# EAGLE board kulgurpowerMCU3-unrouted (EAGLE 6.3)
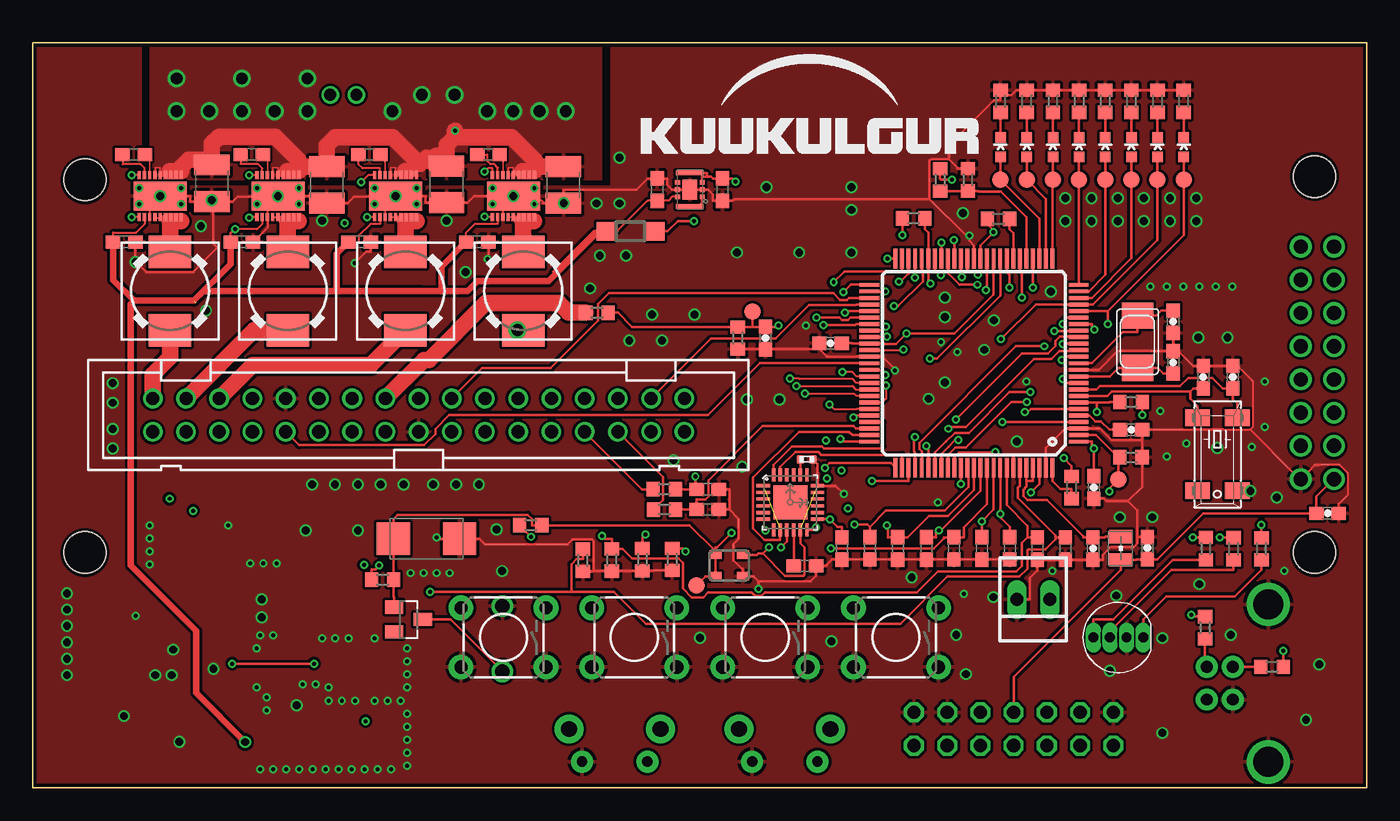
[diagram p6: board, top side]
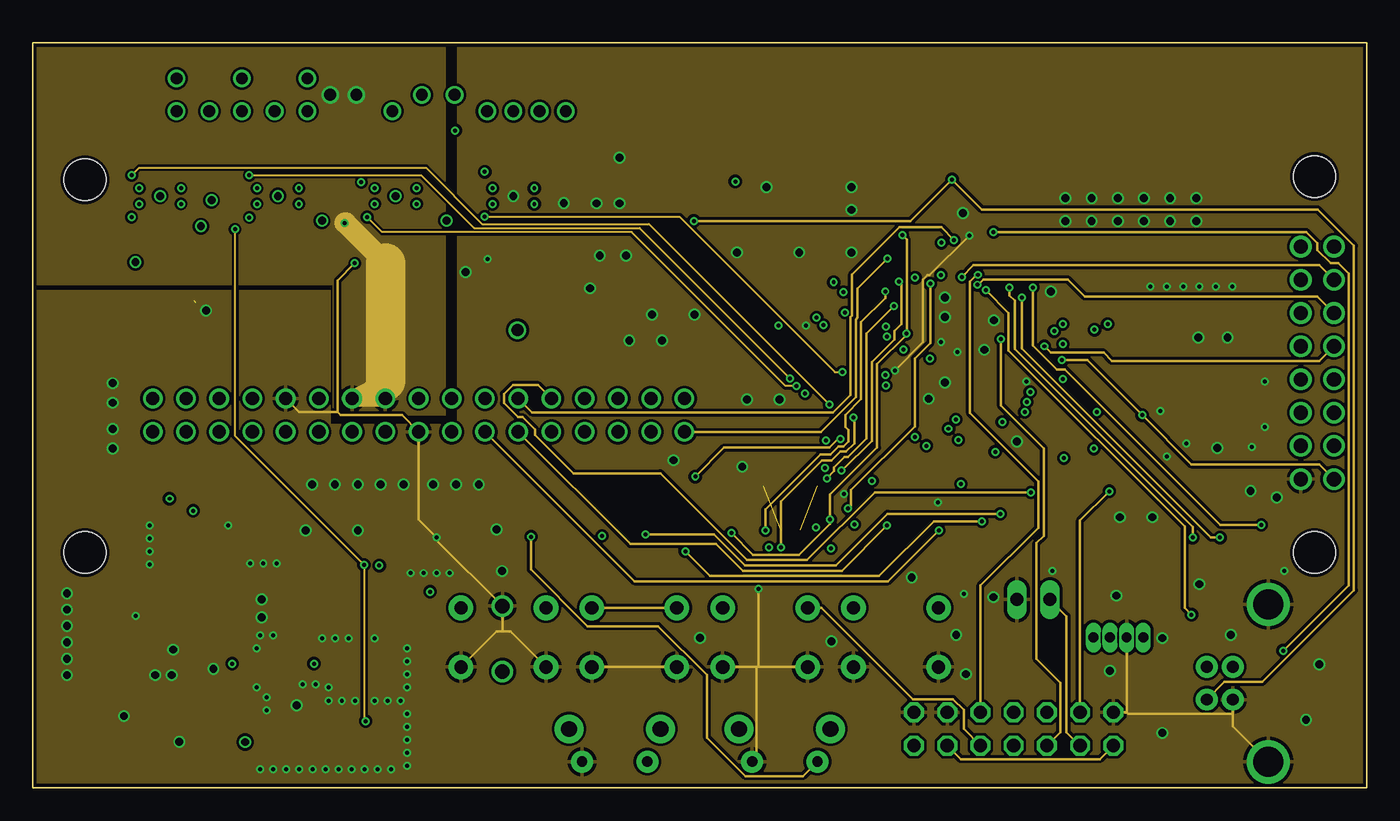
[diagram p7: board, inner layer Route2]
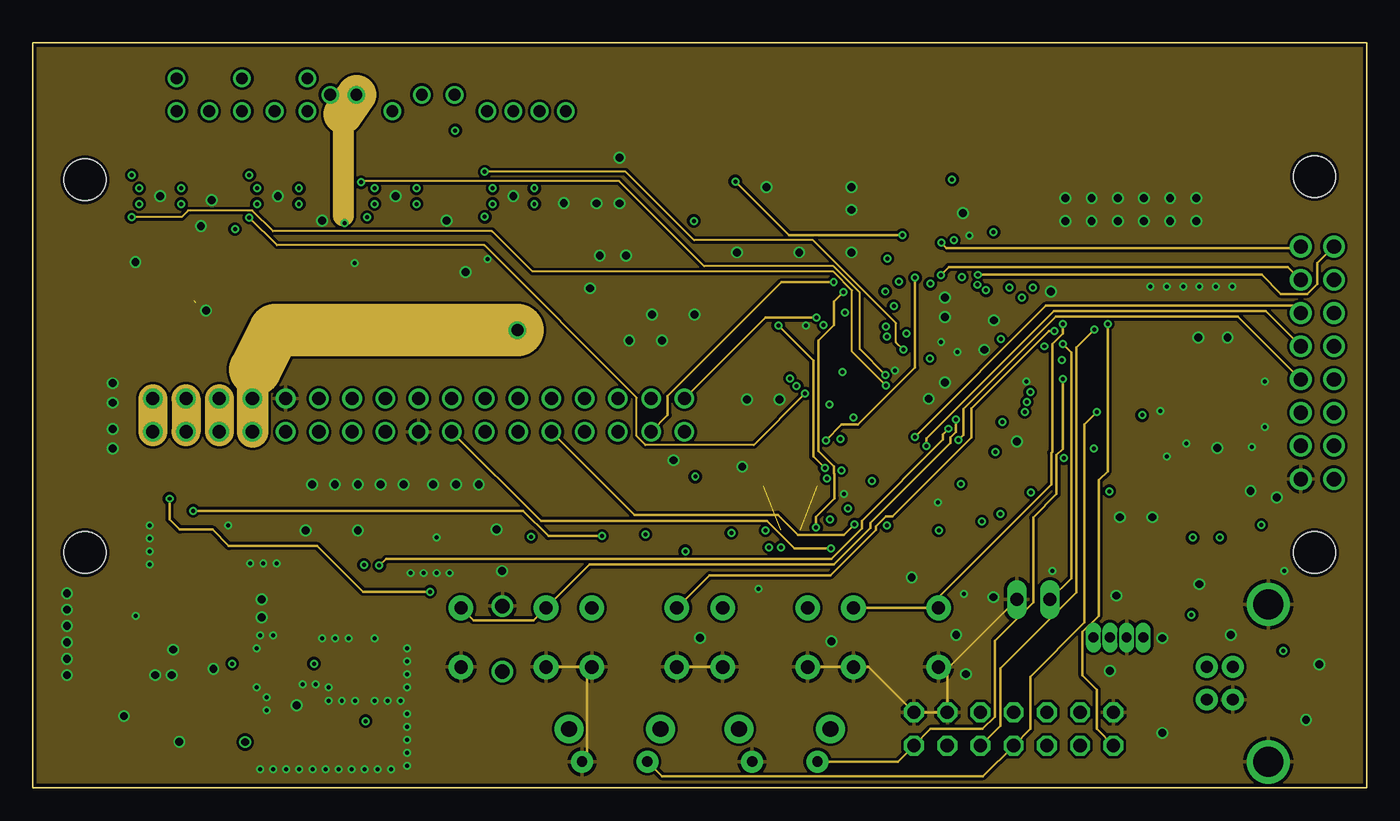
[diagram p8: board, inner layer Route15]
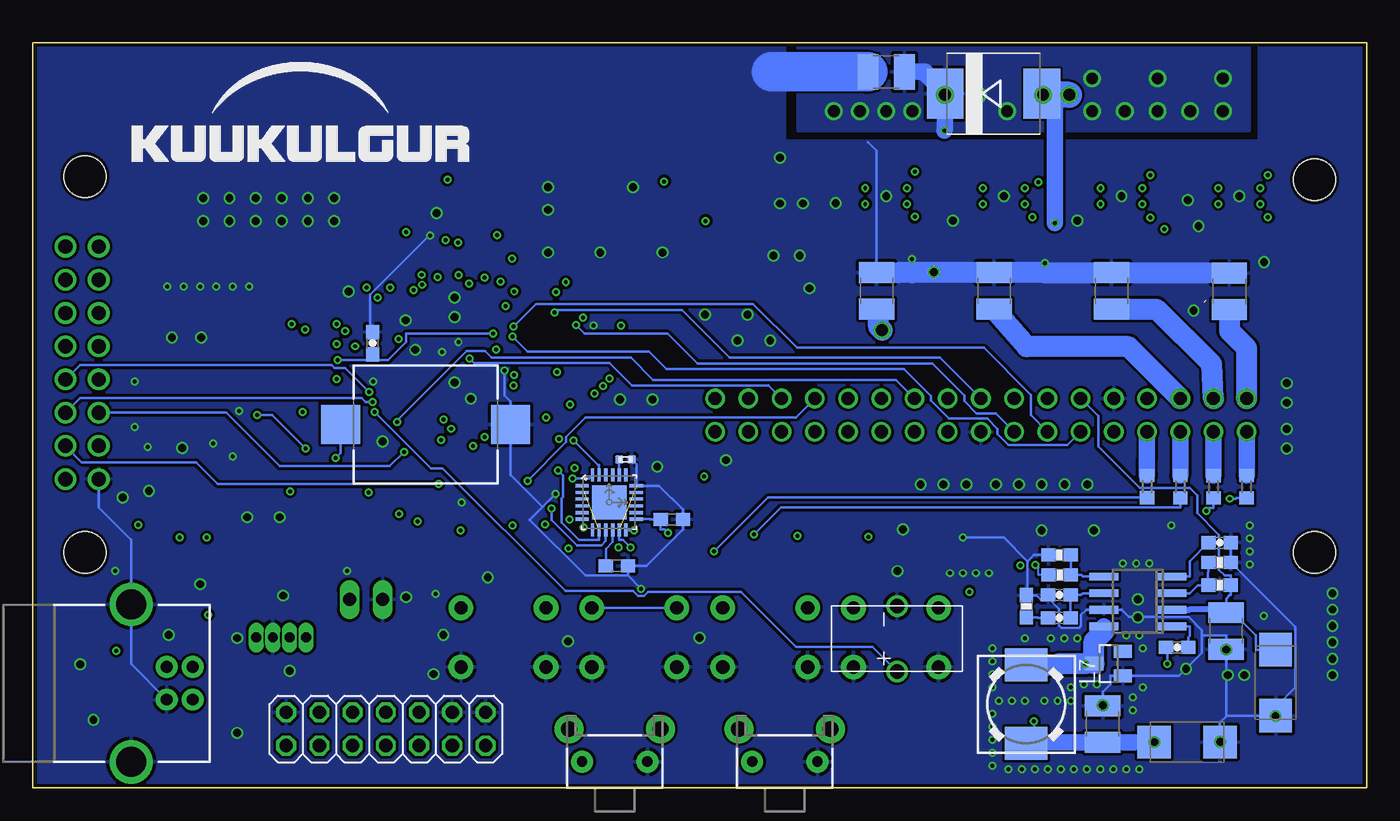
[diagram p9: board, bottom side, seen from below]

Size 102 x 57 mm. Coordinates in mm from the lower left corner, seen from the top.
Outline: 0,0 0,57 102,57 102,0 0,0
Copper layers (1*2*15*16): Top 0.035mm / dielectric 0.2mm / Route2 0.0175mm / dielectric 1.1mm / Route15 0.0175mm / dielectric 0.2mm / Bottom 0.035mm
Design rules "SeeedStudio_DRU_no_angle_20130527": minimum track width 6mil, minimum drill 12mil, track to track 6mil, track to pad 6mil, pad to pad 6mil, via to via 6mil, smd to smd 0mil, copper to edge 10mil, drill to drill 10mil, minimum pad ring 6mil, minimum via ring 6mil, stop-mask expansion 2mil, vias tented up to drill 25mil, thermal gap 10mil
Net classes: 0 default: width 0.203 mm, drill 0.3 mm, clearance 0.203 mm; 1 power: width 0.635 mm, drill 0.6 mm, clearance 0.178 mm; 2 morepower: width 1.27 mm, drill 1 mm, clearance 0.178 mm; 3 thin: width 0.152 mm, drill 0.3 mm, clearance 0.152 mm

## Footprints (pad centres in the part's own frame; a part is rotated, then mirrored left to right if it is on the bottom)
B1,27 = smd 1.27 x 1.27: TP 0,0
C0603 = smd 1.1 x 1: 1 -0.85,0; 2 0.85,0
0603-CAP = smd 1.1 x 1: 1 -0.85,0; 2 0.85,0
C/6032-28R = smd 2.55 x 2.5: + 2.525,0; - -2.525,0
C0402 = smd 0.59 x 0.64: 1 -0.48,0; 2 0.48,0
C1210 = smd 1.6 x 2.7: 1 -1.4,0; 2 1.4,0
SMC = smd 2.8 x 3.8: A 3.7,0; C -3.7,0
SOD123 = smd 1.4 x 1.4: A 1.9,0; C -1.9,0
SOT23 = smd 1 x 1.4: 1 -0.95,-1.1; 2 0.95,-1.1; 3 0,1.1
LED-RGB-THRU = drill 0.762 pad 0.889 long: 1 1.905,0; 2 0.635,0; 3 -0.635,0; 4 -1.905,0
2X07 = drill 1.016 octagon: 1 -7.62,-1.27; 2 -7.62,1.27; 3 -5.08,-1.27; 4 -5.08,1.27; 5 -2.54,-1.27; 6 -2.54,1.27; 7 0,-1.27; 8 0,1.27; 9 2.54,-1.27; 10 2.54,1.27; 11 5.08,-1.27; 12 5.08,1.27; 13 7.62,-1.27; 14 7.62,1.27
WE-KI_0805_B = smd 1.02 x 1.78: 1 -0.89,0; 2 0.89,0
DR73 = smd 2.5 x 3.25: 1 -3,0; 2 3,0
LED-0603 = smd 0.8 x 0.8: A 0,-0.75; C 0,0.75
MM20SS = smd 1.27 x 1.88: 1 -2.794,-1.524; 2 2.794,-1.524; 3 2.794,1.524; 4 -2.794,1.524
R0603 = smd 1 x 1.1: 1 -0.85,0; 2 0.85,0
0603-RES = smd 1.1 x 1: 1 -0.85,0; 2 0.85,0
TACTILE-PTH-SIDEEZ = drill 0.8 pad 1.7: 1 -2.5,0; 2 2.5,0 | drill 1.2 pad 2.2: ANCHOR1 -3.5,2.5; ANCHOR2 3.5,2.5
TACTILE-PTH = drill 1.016 pad 1.88: 1 -3.251,2.261; 2 3.251,2.261; 3 -3.251,-2.261; 4 3.251,-2.261
BUZZER-CMT1102 = smd 3 x 3: 1 -6.5,0; 2 6.5,0
QFN-24-TESTING = smd 1.016 x 0.254: 1 -2.066,1.257; 2 -2.066,0.75; 3 -2.066,0.247; 4 -2.066,-0.287; 5 -2.066,-0.792; 6 -2.066,-1.297; 13 2.086,-1.297; 14 2.086,-0.792; 15 2.086,-0.287; 16 2.086,0.247; 17 2.086,0.75; 18 2.086,1.257 | smd 0.254 x 1.016: 7 -1.267,-2.122; 8 -0.762,-2.122; 9 -0.258,-2.122; 10 0.278,-2.122; 11 0.78,-2.122; 12 1.287,-2.122; 19 1.287,2.082; 20 0.78,2.082; 21 0.278,2.082; 22 -0.258,2.082; 23 -0.762,2.082; 24 -1.267,2.082 | smd 2.616 x 2.616: P$1 0.02,-0.01
EDLRD224V3R6C = drill 1.1: N 2.5,0; P -2.5,0
USB-B-PTH = drill 0.914 pad 1.676: D+ 0,1.25; D- 1.981,1.25; GND 0,-1.25; VBUS 1.981,-1.25 | drill 2.286: S1 -2.718,-6.02; S2 -2.718,6.02
ER-OLEDM032-1 = drill 1.1: P$1 96.2,8.11; P$2 98.74,8.11; P$3 96.2,10.65; P$4 98.74,10.65; P$5 96.2,13.19; P$6 98.74,13.19; P$7 96.2,15.73; P$8 98.74,15.73; P$9 96.2,18.27; P$10 98.74,18.27; P$11 96.2,20.81; P$12 98.74,20.81; P$13 96.2,23.35; P$14 98.74,23.35; P$15 96.2,25.89; P$16 98.74,25.89 | hole 3.2: 3.25,31; 3.25,2.5; 97.25,2.5; 97.25,31.25
ASE = smd 0.9 x 0.65: 1 -1.05,-0.825; 2 1.05,-0.825; 3 1.05,0.825; 4 -1.05,0.825
SO8 = smd 0.6 x 2.2: 1 -1.905,-2.6; 2 -0.635,-2.6; 3 0.635,-2.6; 4 1.905,-2.6; 5 1.905,2.6; 6 0.635,2.6; 7 -0.635,2.6; 8 -1.905,2.6
CL2025 = smd 0.35 x 0.375: P$1 -0.55,-0.938; P$2 0,-0.938; P$3 0.55,-0.938; P$4 0.55,0.938; P$5 0,0.938; P$6 -0.55,0.938 | smd 0.35 x 2.1: P$7 -1.275,0; P$8 1.275,0 | smd 1.5 x 1.1: PAD 0,0
LTQFP100 = smd 1.5 x 0.3: 1 -8,6; 2 -8,5.5; 3 -8,5; 4 -8,4.5; 5 -8,4; 6 -8,3.5; 7 -8,3; 8 -8,2.5; 9 -8,2; 10 -8,1.5; 11 -8,1; 12 -8,0.5; 13 -8,0; 14 -8,-0.5; 15 -8,-1; 16 -8,-1.5; 17 -8,-2; 18 -8,-2.5; 19 -8,-3; 20 -8,-3.5; 21 -8,-4; 22 -8,-4.5; 23 -8,-5; 24 -8,-5.5; 25 -8,-6; 51 8,-6; 52 8,-5.5; 53 8,-5; 54 8,-4.5; 55 8,-4; 56 8,-3.5; 57 8,-3; 58 8,-2.5; 59 8,-2; 60 8,-1.5; 61 8,-1; 62 8,-0.5; 63 8,0; 64 8,0.5; 65 8,1; 66 8,1.5; 67 8,2; 68 8,2.5; 69 8,3; 70 8,3.5; 71 8,4; 72 8,4.5; 73 8,5; 74 8,5.5; 75 8,6 | smd 0.3 x 1.5: 26 -6,-8; 27 -5.5,-8; 28 -5,-8; 29 -4.5,-8; 30 -4,-8; 31 -3.5,-8; 32 -3,-8; 33 -2.5,-8; 34 -2,-8; 35 -1.5,-8; 36 -1,-8; 37 -0.5,-8; 38 0,-8; 39 0.5,-8; 40 1,-8; 41 1.5,-8; 42 2,-8; 43 2.5,-8; 44 3,-8; 45 3.5,-8; 46 4,-8; 47 4.5,-8; 48 5,-8; 49 5.5,-8; 50 6,-8; 76 6,8; 77 5.5,8; 78 5,8; 79 4.5,8; 80 4,8; 81 3.5,8; 82 3,8; 83 2.5,8; 84 2,8; 85 1.5,8; 86 1,8; 87 0.5,8; 88 0,8; 89 -0.5,8; 90 -1,8; 91 -1.5,8; 92 -2,8; 93 -2.5,8; 94 -3,8; 95 -3.5,8; 96 -4,8; 97 -4.5,8; 98 -5,8; 99 -5.5,8; 100 -6,8
CSD97374Q4M = smd 0.25 x 0.6: P$1 -1.6,-1.6; P$2 -1.2,-1.6; P$3 -0.8,-1.6; P$4A -0.4,-1.6; P$4B 0,-1.6; P$4C 0.4,-1.6; P$4D 0.8,-1.6; P$4E 1.2,-1.6; P$4F 1.6,-1.6; P$5A -0.4,1.6; P$5B 0,1.6; P$5C 0.4,1.6; P$5D 0.8,1.6; P$5E 1.2,1.6; P$5F 1.6,1.6; P$6 -0.8,1.6; P$7 -1.2,1.6; P$8 -1.6,1.6 | smd 4.05 x 2.2: PAD@1 0,0 | drill 0.3: PAD@9 -1.6,0.6; PAD@10 -1.6,-0.6; PAD@11 1.6,0.6; PAD@12 1.6,-0.6
NX5032 = smd 2 x 2.4: P$1 2,0; P$2 -2,0
PAK100/2500-34 = drill 1 pad 1.422: 1 -20.32,-1.27; 2 -20.32,1.27; 3 -17.78,-1.27; 4 -17.78,1.27; 5 -15.24,-1.27; 6 -15.24,1.27; 7 -12.7,-1.27; 8 -12.7,1.27; 9 -10.16,-1.27; 10 -10.16,1.27; 11 -7.62,-1.27; 12 -7.62,1.27; 13 -5.08,-1.27; 14 -5.08,1.27; 15 -2.54,-1.27; 16 -2.54,1.27; 17 0,-1.27; 18 0,1.27; 19 2.54,-1.27; 20 2.54,1.27; 21 5.08,-1.27; 22 5.08,1.27; 23 7.62,-1.27; 24 7.62,1.27; 25 10.16,-1.27; 26 10.16,1.27; 27 12.7,-1.27; 28 12.7,1.27; 29 15.24,-1.27; 30 15.24,1.27; 31 17.78,-1.27; 32 17.78,1.27; 33 20.32,-1.27; 34 20.32,1.27
22-23-2021 = drill 1 long: 1 -1.27,0; 2 1.27,0

## Placement (x,y rotation side)
AN0  TPB1,27  [B1,27]  55.05,36.42 90 top
C1  0.1  [C0603]  72.57,18.31 270 top
C2  0.1  [C0603]  74.69,18.32 270 top
C3  0.1  [C0603]  66.13,18.31 270 top
C4  0.1  [0603-CAP]  83.98,27.39 180 top
C5  0.1  [C0603]  64.01,18.32 270 top
C6  18pf  [0603-CAP]  87.19,32.54 270 top
C7  18pf  [0603-CAP]  87.19,35.64 90 top
C8  0.1  [C0603]  76.82,18.3 270 top
C9  [0603-CAP]  89.49,31.41 270 top
C10  0.1  [C0603]  68.32,18.31 270 top
C11  [0603-CAP]  91.76,31.41 270 top
C12  0.1  [0603-CAP]  56.03,34.4 270 top
C13  0,1  [0603-CAP]  81.07,18.3 270 top
C14  0,1  [0603-CAP]  85.23,18.33 90 top
C15  0.1  [C0603]  78.94,18.3 270 top
C17  0.1  [C0603]  70.44,18.32 270 top
C18  [C/6032-28R]  30.11,19.05 180 top
C19  100n  [C0603]  59.05,16.97 0 top
C20  2.2nF / 50V  [C0402]  59.18,25.12 0 top
C21  100n  [C0603]  61.88,18.3 270 top
C22  0.1  [C0603]  51.61,22.83 0 top
C24  100n  [C0603]  57.33,16.98 0 bottom
C25  2.2nF / 50V  [C0402]  56.68,25.11 0 bottom
C26  100n  [C0603]  53.13,20.52 0 bottom
C27  0.1  [C0603]  7.72,48.41 0 top
C28  0.1  [0603-CAP]  14.5,10.75 0 bottom
C29  0.1  [C0603]  25,41.75 0 top
C30  22uF/25V  [C1210]  31.64,46.15 270 top
C31  0.1  [C0603]  16.75,48.43 0 top
C32  0.1  [C0603]  7,41.75 0 top
C33  22uF/25V  [C1210]  40.57,46.11 270 top
C34  0.1  [C0603]  25.74,48.43 0 top
C35  0.1  [C0603]  16,41.75 0 top
C36  22uF/25V  [C1210]  22.49,46.11 270 top
C37  0.1  [C0603]  34.84,48.43 0 top
C38  0.1  [C0603]  34,41.75 0 top
C39  22uF/25V  [C1210]  13.69,46.24 270 top
C40  0.1  [C0603]  51.61,21.29 0 top
C42  [C1210]  10.51,37.98 90 bottom
C43  [C1210]  19.52,38 90 bottom
C44  [C1210]  28.5,38 90 bottom
C45  [C1210]  37.48,38 90 bottom
C46  0,1  [0603-CAP]  61,34 180 top
C47  0,1  [0603-CAP]  76,34 90 bottom
C48  0,1  [0603-CAP]  81.14,22.98 270 top
C49  0,1  [0603-CAP]  99,21 0 top
C50  22uF/25V  [C1210]  36.75,54.75 180 bottom
C51  12pF  [0603-CAP]  23.5,14.75 180 bottom
C52  180pF  [0603-CAP]  23.5,13 180 bottom
C53  10uF / 6.3V  [C0603]  52.75,45.75 90 top
C54  4.7uF / 10V  [C0603]  47.75,45.75 270 top
C55  15nF  [0603-CAP]  11.25,18.75 180 bottom
C56  GRM32ER71E226KE15L  [C1210]  10.75,12 270 bottom
C57  GRM32ER71E226KE15L  [C1210]  20.19,4.89 90 bottom
C58  100uF/16V  [C/6032-28R]  6.98,8.04 90 bottom
C100  100uF/10V  [C/6032-28R]  13.75,3.5 180 bottom
D1  MBRS320T3  [SMC]  28.54,53.08 0 bottom
D2  MBR0520LT  [SOD123]  45.69,42.56 0 top
D7  BAT54  [SOT23]  28.73,12.87 270 top
D8  WP154A4SUREQBFZGW  [LED-RGB-THRU]  83,11.5 0 top
D100  BAT54  [SOT23]  19.75,9.5 90 bottom
EMLE  TPB1,27  [B1,27]  82.99,23.58 0 top
JP2  [2X07]  75,4.5 0 bottom
L1  4,7uH  [WE-KI_0805_B]  83.19,18.32 90 top
L2  4,7uH  [DR73]  10.5,38 270 top
L3  4,7uH  [DR73]  19.5,38 270 top
L4  4,7uH  [DR73]  28.5,38 270 top
L5  4,7uH  [DR73]  37.5,38 270 top
L7  4,7uH  [DR73]  26.04,6.4 270 bottom
LED0  [LED-0603]  74,49 0 top
LED1  [LED-0603]  76,49 0 top
LED2  [LED-0603]  78,49 0 top
LED3  [LED-0603]  80,49 0 top
LED4  [LED-0603]  82,49 0 top
LED5  [LED-0603]  84,49 0 top
LED6  [LED-0603]  86,49 0 top
LED7  [LED-0603]  88,49 0 top
Q1  [MM20SS]  90.57,25.51 270 top
R1  301k  [R0603]  16.8,23.04 270 bottom
R2  100k  [R0603]  48.89,17.47 270 top
R3  301k  [R0603]  14.26,23.03 270 bottom
R4  100k  [R0603]  46.62,17.45 270 top
R5  47k  [R0603]  83.98,29.51 0 top
R6  47k  [R0603]  26.76,15.91 0 top
R7  1k  [R0603]  74,52.5 270 top
R8  1k  [R0603]  76,52.5 270 top
R9  47k  [R0603]  67.36,43.54 0 top
R10  1k5  [R0603]  73.84,43.51 180 top
R11  301k  [R0603]  11.72,23.02 270 bottom
R12  1k  [R0603]  78,52.5 270 top
R13  100k  [R0603]  44.28,17.42 270 top
R14  1k  [R0603]  80,52.5 270 top
R15  47k  [R0603]  83.97,25.27 0 top
R16  301k  [R0603]  9.19,23.03 270 bottom
R17  100k  [R0603]  42.06,17.4 270 top
R18  100k  [R0603]  53.92,34.4 270 top
R19  1k  [R0603]  79.43,22.96 270 top
R20  100k  [0603-RES]  11.25,15.5 0 bottom
R21  63k4  [0603-RES]  26.03,13.89 270 bottom
R22  47k  [R0603]  38.08,20.08 180 top
R23  680k  [R0603]  43.14,36.33 180 top
R24  22r  [R0603]  89.63,12.24 270 top
R25  22r  [R0603]  94.75,9.25 180 top
R26  30k  [R0603]  71.5,46.5 90 top
R27  17k  [R0603]  69.38,46.49 270 top
R28  1k  [R0603]  82,52.5 270 top
R29  1k  [R0603]  84,52.5 270 top
R30  1k  [R0603]  86,52.5 270 top
R31  1k  [R0603]  88,52.5 270 top
R32  1k  [R0603]  93.94,18.27 90 top
R33  1k  [R0603]  91.81,18.28 90 top
R34  1k  [R0603]  89.69,18.29 90 top
R35  10k  [R0603]  48.29,22.83 0 top
R36  10k  [R0603]  48.31,21.29 0 top
R37  1k87  [0603-RES]  23.49,17.81 180 bottom
R38  10k  [0603-RES]  23.48,16.28 0 bottom
R45  21k5  [0603-RES]  11.25,17.25 180 bottom
S1  PROG  [TACTILE-PTH-SIDEEZ]  44.5,2 0 bottom
S2  SW4  [TACTILE-PTH]  66,11.5 180 top
S6  SW1  [TACTILE-PTH]  36,11.5 180 top
S7  SW2  [TACTILE-PTH]  46,11.5 180 top
S8  SW3  [TACTILE-PTH]  56,11.5 180 top
S9  RESET  [TACTILE-PTH-SIDEEZ]  57.5,2 0 bottom
SG1  BUZZERSMD3  [BUZZER-CMT1102]  71.97,27.79 0 bottom
TP1  TPB1,27  [B1,27]  50.75,15.5 0 top
TPLED0  LED0  [B1,27]  74,46.5 90 top
TPLED1  LED0  [B1,27]  76,46.5 90 top
TPLED2  LED0  [B1,27]  78,46.5 90 top
TPLED3  LED0  [B1,27]  80,46.5 90 top
TPLED4  LED0  [B1,27]  82,46.5 90 top
TPLED5  LED0  [B1,27]  84,46.5 90 top
TPLED6  LED0  [B1,27]  86,46.5 90 top
TPLED7  LED0  [B1,27]  88,46.5 90 top
U1  MPU-6000QFN-24  [QFN-24-TESTING]  57.91,21.84 0 top
U2  MPU-6000QFN-24  [QFN-24-TESTING]  57.93,21.84 0 bottom
U$1  EDLRD224V3R6C  [EDLRD224V3R6C]  35.91,11.4 90 bottom
U$2  USB+SHIELD  [USB-B-PTH]  91.75,8 0 bottom
U$3  ER-OLEDM032-1  [ER-OLEDM032-1]  0.75,15.5 0 top
U$4  ASE  [ASE]  53.25,17 0 top
U$5  TPS54332  [SO8]  17.5,14.25 90 bottom
U$6  XCL202B331BR-G  [CL2025]  50.25,45.75 90 top
U$14  R5F5630ADDFP  [LTQFP100]  71.97,32.47 180 top
U$16  CSD97374Q4M  [CSD97374Q4M]  9.75,45.25 0 top
U$17  CSD97374Q4M  [CSD97374Q4M]  18.75,45.25 0 top
U$18  CSD97374Q4M  [CSD97374Q4M]  27.75,45.25 0 top
U$19  CSD97374Q4M  [CSD97374Q4M]  36.75,45.25 0 top
X1  12Mhz  [NX5032]  84.47,34.12 270 top
X2  2534-  [PAK100/2500-34]  29.5,28.5 0 top
X3  22-23-2021  [22-23-2021]  76.5,14.4 180 top

## Tracks (layer width: path | path; a pad name or v marks a point on that pad's centre or on a via)
5V  (via drill 0.3 pad 0.61, 0.6 pad 0.3)  (1 unrouted)
  Top 0.152: 12.45,37.12 10.05,37.12 | 39.76,39.46 42.86,42.56 43.25,42.56 D2.C 44.72,42.56 44.72,42.6 47.02,44.9 C54.2 48.6,44.9 48.9,45.2 U$6.P$6 | C29.1 24.93,41.75 24.93,42.22 25.83,43.12 26.55,43.12 U$18.P$2 | U$17.P$2 17.55,43.12 17.15,42.72 v15.46,42.72 15.22,42.48 15.15,42.48 C35.1 | 33.15,41.77 C38.1 33.15,41.77 | 33.15,41.77 33.15,42.48 33.79,43.12 35.55,43.12 U$19.P$2 | 6.15,41.02 C32.1 6.15,42.48 7.91,42.48 8.55,43.12 U$16.P$2
  Top 0.508: 12.32,37.25 7.75,37.25 | 7.75,37.25 7.5,37 7.5,17 12.5,12 12.5,7.25 v16.25,3.5 | v16.25,3.5 C100.+ v16.25,3.5 | 12.32,37.25 13.07,38 23.25,38 | 23.25,38 29.75,38 | 29.75,38 31.25,38 | 31.25,38 33.25,38 34,38.75 39.44,38.75 43.25,42.56 | 7.75,37.25 6.15,38.85 C32.1 | 29.75,38 23.25,38 | 23.25,38 23.25,40.85 C29.1 | 33.15,41.77 31.25,39.87 31.25,38 | 12.32,37.25 15.13,40.05 15.13,41.76
  Route2 0.152: v15.46,42.72 15.46,26.91 v25.32,17.05 25.32,5.24 v25.45,5.11 | v15.46,42.72
  Bottom 0.152: R38.1 25.1,16.28 25.1,16.83 v25.32,17.05 | C100.+ 17.78,3.5 17.79,3.49 | L7.2 25.54,3.4 25.45,3.49 v25.45,5.11
  Bottom 0.508: C100.+ v16.25,3.5
  Bottom 1.27: 17.79,3.49 C57.1 25.45,3.49
!OLED_CS  (via drill 0.3 pad 0.61)
  Top 0.203: v72.27,39.23 72.03,39.47 71.47,39.47 U$14.39
  Route2 0.203: JP2.10 72.46,15.46 76.88,19.88 76.88,23.45 71.66,28.66 71.66,38.7 72.2,39.23 v72.27,39.23
  Route15 0.203: v72.27,39.23 93.96,39.23 95.42,37.77 97.46,37.77 98.22,38.53 98.22,40.12 U$3.P$16
!OLED_DC  (via drill 0.3 pad 0.61)
  Top 0.203: U$14.40 70.97,39.47 71.04,39.4 v71.04,39.08
  Route2 0.203: v71.04,39.08 71.93,39.97 98.37,39.97 U$3.P$14
!OLED_RD  (via drill 0.3 pad 0.61)
  Top 0.203: v72.22,38.47 70.85,38.47 70.01,39.31 70.01,40.43 U$14.42
  Route2 0.203: U$3.P$12 98.22,37.58 80.43,37.58 79.14,38.87 72.7,38.87 72.3,38.47 v72.22,38.47
!OLED_RESET  (via drill 0.3 pad 0.61)
  Top 0.203: U$14.43 v69.47,41.69
  Route15 0.203: v69.47,41.69 69.87,41.28 96.84,41.28 U$3.P$15
!OLED_WR  (via drill 0.3 pad 0.61)
  Top 0.203: U$14.44 68.97,39.47 69.2,39.47 v69.44,39.23
  Route15 0.203: U$3.P$13 95.97,39.83 70.03,39.83 v69.44,39.23
!RESET  (via drill 0.3 pad 0.61)
  Top 0.203: v78.76,31.25 78.97,31.04 78.97,30.97 U$14.10 | v38.1,19.21 R22.2
  Route2 0.203: S9.1 58.89,0.89 54.51,0.89 51.55,3.84 51.55,8.62 47.82,12.36 42.43,12.36 38.1,16.69 v38.1,19.21
  Route15 0.203: v78.76,31.25 78.76,25.92 78.28,25.45 78.28,22.46 76.5,20.68 76.5,14.17 73.58,11.24 73.58,5.45 72.63,4.5 68.65,4.5 JP2.13 66.15,2 S9.1
!SKIP0  (via drill 0.3 pad 0.61)
  Top 0.152: U$16.P$1 v7.55,43.65 | U$14.69 64.95,29.47 65.24,29.76 v65.24,30.77
  Route15 0.152: v65.24,30.77 62.65,33.36 62.65,38.04 61.2,39.48 38.2,39.48 35.11,42.58 18.37,42.58 16.79,44.15 11.88,44.15 11.38,43.65 v7.55,43.65
!SKIP1  (via drill 0.3 pad 0.61)
  Top 0.152: U$17.P$1 16.59,43.65 v16.56,43.62 | v59.06,30.15 62.81,30.15 62.99,29.97 U$14.68
  Route15 0.152: v59.06,30.15 55.13,26.22 46.85,26.22 46.17,26.9 46.17,29.85 34.53,41.49 18.68,41.49 v16.56,43.62
!SKIP2  (via drill 0.3 pad 0.61)
  Top 0.152: U$18.P$1 v25.56,43.65 | v58.41,30.73 62.66,30.73 62.92,30.47 U$14.67
  Route2 0.152: v58.41,30.73 57.57,30.73 45.8,42.5 26.71,42.5 v25.56,43.65
!SKIP3  (via drill 0.3 pad 0.61)
  Top 0.152: v61.89,31.79 62.67,31.79 62.99,31.47 U$14.65 | U$19.P$1 34.59,43.65 v34.57,43.67
  Route2 0.152: v34.57,43.67 49.45,43.67 61.32,31.79 v61.89,31.79
!SW1  (via drill 0.3 pad 0.61)
  Top 0.203: v70.59,28.16 75.64,33.21 77.62,33.21 78.2,33.79 78.2,34.18 78.53,34.5 79.94,34.5 U$14.17
  Route15 0.203: v70.59,28.16 70.59,27.2 70.18,26.8 70.18,26.39 64.05,20.26 64.05,19.88 61.24,17.07 42.56,17.07 S6.3 38.31,12.82 33.69,12.82 S6.4
!SW2  (via drill 0.3 pad 0.61)
  Top 0.203: U$14.18 79.92,34.92 v78.1,34.92
  Route2 0.203: S7.3 S7.4
  Route15 0.203: S7.3 51.75,16.26 61.01,16.26 64.45,19.71 64.45,19.99 65.22,20.76 65.73,20.76 71.76,26.79 71.76,29 77.68,34.92 v78.1,34.92
!SW3!/TMS  (via drill 0.3 pad 0.61)
  Top 0.203: v81.18,35.03 80.97,35.24 80.97,35.47 U$14.19
  Route2 0.203: JP2.9 71.19,4.5 71.19,5.96 70.36,6.79 67.3,6.79 60.32,13.76 S8.3
  Route15 0.203: v81.18,35.03 79.81,33.66 79.81,14.96 73.98,9.14 73.98,4.75 JP2.9
  Bottom 0.203: S8.4 S8.3
!SW4!/TDI  (via drill 0.3 pad 0.61)
  Top 0.203: v78.76,35.48 78.97,35.68 78.97,35.97 U$14.20
  Route15 0.203: S2.4 S2.3 69.25,14.57 77.88,23.2 77.88,25.62 77.95,25.69 77.95,33.95 78.76,34.76 v78.76,35.48
!TRST  (via drill 0.3 pad 0.61)
  Top 0.203: U$14.16 78.97,33.97 78.94,33.94 v78.76,33.94
  Route2 0.203: X3.1 79.05,13.12 79.05,4.26 JP2.3
  Route15 0.203: v78.76,33.94 79.4,33.3 79.4,16.02 X3.1
+3V3  (via drill 0.3 pad 0.61)
  Top 0.203: v78.7,32.7 78.97,32.97 U$14.14 | 52.2,18.11 50.23,20.08 39.68,20.08 R22.1 38.17,20.08 38.17,20.55 37.84,20.89 27.92,20.89 27.58,20.55 C18.+ 27.58,17.54 27.61,17.52 27.61,16.72 R6.2 27.61,14.6 27.63,14.57 D7.1 | U$14.35 73.47,39.47 73.47,37.74 70.46,34.73 v66.8,34.73 66,33.92 65.02,33.92 64.97,33.97 U$14.60 62.68,33.97 62.65,34 C46.1 | JP2.8 75,8.47 83.19,16.67 L1.1 84.34,17.43 84.39,17.48 C14.1 85.98,17.48 89.5,21 C49.1 98.15,22.27 U$3.P$2 | C48.1 81.14,24.63 v81.14,25.94 80.97,26.1 80.97,26.47 U$14.1 | v84.83,28.5 84.83,28.7 R5.2 | 52.2,18.11 52.2,18.4 52.32,18.4 v53.41,19.49 | 52.2,18.11 U$4.4 U$4.1 51.42,16.18 TP1.TP | v53.72,46.37 53.5,46.58 53.5,46.6 C53.2 52.37,46.6 52,46.6 51.87,46.73 51.55,46.73 | R9.1 66.51,42.29 v66.48,42.27 | C21.1 61.88,19.96 61.52,19.96 v60.97,20.51 60.94,20.55 U1.13 | U$6.P$8 51.55,47.02 51.55,46.73 | U$6.P$3 51.19,46.73 51.55,46.73
  Route2 0.203: v60.97,20.51 | v60.97,20.51 60.97,22.43 64.56,26.02 64.56,32.4 66.8,34.64 v66.8,34.73 66.83,34.76 66.83,41.92 v66.48,42.27 | v78.7,32.7 80.62,32.7 v84.83,28.5 88.59,24.74 98.36,24.74 U$3.P$2 | v53.41,19.49 55.08,17.82 58.6,17.82 60.97,20.18 v60.97,20.51
  Route15 0.203: v66.48,42.27 57.82,42.27 v53.72,46.37
  Bottom 0.203: v78.7,32.7 76,32.7 | 76,32.7 74.84,32.7 73.46,34.08 73.46,34.73 v66.8,34.73 | v84.83,28.5 83.69,28.5 v81.14,25.94 | U2.13 54.81,20.55 54.79,20.52 C26.1 53.98,19.77 53.69,19.77 v53.41,19.49 | C47.1 76,32.7
+19V  (via drill 0.3 pad 0.61, 0.9 pad 0.61)
  Top 1.27: R23.2 40.97,36.33 40.24,37.06 34.64,37.06 30.3,32.72 29.91,32.72 X2.16
  Route2 1.27: 27,31.1 X2.14 X2.16
  Route2 1.6: 27,40.14 23.94,43.2 v23.86,43.2
  Route2 3: 27,31.1 27,40.14
  Route15 1.6: 23.75,51.5 23.75,43.75
  Route15 3: v24.75,53 23.75,51.5
  Bottom 1.27: D1.A 24.38,52.58 23.86,52.06 v23.86,43.2
  Bottom 2: v22.75,53 v24.75,53 24.76,53 D1.A
  pour Route2: 31.5,28.5 23,28.5 23,38.5 0,38.5 0,56.75 31.5,56.75
AN0  (via drill 0.3 pad 0.61)
  Top 0.203: U$14.76 65.61,24.83 60.93,24.83 v60.56,24.46 | v57,35.35 56.88,35.35 56.78,35.25 C12.1 55.05,35.25 | 55.05,35.25 AN0.TP | 55.05,35.25 54.72,35.25 R18.1 45.82,35.25 44.74,36.33 R23.1
  Route15 0.203: v60.56,24.46 59.68,25.34 59.68,32.67 v57,35.35
AN1  (via drill 0.3 pad 0.61)
  Top 0.203: v61.77,26.67 61.97,26.47 U$14.75 | 50.66,22.84 v50.66,23.8 | 50.66,22.84 49.89,22.84 R35.2 | C22.1 50.66,22.84
  Route2 0.203: v50.66,23.8 52.87,26.02 60.92,26.02 61.58,26.67 v61.77,26.67
AN3
  Top 0.203: U$14.73 62.94,27.47 62.75,27.66 55.8,27.66 51.66,23.51 51.66,22.27 51.42,22.04 50.76,22.04 C40.1 49.91,21.29 R36.2
AVCC0
  Top 0.203: 75.97,23.47 75.97,23.03 75.73,22.79 75.73,22.33 76.06,22 77.56,22 80.31,19.24 80.31,19.15 C13.1 81.98,19.15 82.05,19.21 L1.2 | 75.97,23.47 76.47,23.47 U$14.97 | U$14.96 75.97,23.47
BAT0_EN
  Top 0.203: X2.9 20.37,26.2 29.92,26.2 30.79,27.07 30.79,27.44 31.84,28.5 51.62,28.5 55.59,32.47 62.97,32.47 U$14.63
BAT1_EN  (via drill 0.3 pad 0.61)
  Top 0.203: U$14.59 65.27,34.47 v65.29,34.5
  Bottom 0.203: X2.11 22.89,26.22 27.4,26.22 28.23,27.05 28.23,27.45 29.01,28.23 31.94,28.23 33.31,29.6 33.31,29.96 35.37,32.03 53.55,32.03 54.89,33.36 64.16,33.36 v65.29,34.5
BAT2_EN  (via drill 0.3 pad 0.61)
  Top 0.203: v65.23,35.27 64.97,35.02 64.97,34.97 U$14.58
  Bottom 0.203: v65.23,35.27 63.52,36.98 46.91,36.98 43.58,33.65 29.29,33.65 25.69,30.05 25.69,28.5 X2.13
BAT3_EN  (via drill 0.3 pad 0.61)
  Top 0.203: v60.46,35.38 62.88,35.38 62.97,35.47 U$14.57
  Bottom 0.203: X2.15 28.37,28.64 29.83,28.64 30.77,29.58 30.77,29.99 33.22,32.43 51.16,32.43 53.45,34.73 59.81,34.73 v60.46,35.38
BUZZER
  Top 0.203: R19.2 79.43,22.87 78.57,22.87 77.97,23.47 U$14.100
BUZZER_X  (via drill 0.3 pad 0.61)
  Top 0.203: R19.1 79.43,24.63 v78.84,25.22
  Bottom 0.203: v78.84,25.22 78.47,25.59 78.47,26.04 SG1.1
COMPUTER_PWR  (via drill 0.3 pad 0.61)
  Top 0.203: v64.18,23.47 66.97,23.47 U$14.78
  Bottom 0.203: X2.28 43.63,28.34 59.71,28.34 61.21,26.84 61.21,26.44 v64.18,23.47
CPOUT1
  Top 0.203: U1.20 C20.1
CPOUT2
  Bottom 0.203: U2.20 C25.1
D0  (via drill 0.3 pad 0.61)
  Top 0.203: U$14.86 v70.97,23.25
  Bottom 0.203: U$3.P$4 98.23,24.89 89.51,24.89 87.86,23.25 v70.97,23.25
D1  (via drill 0.3 pad 0.61)
  Top 0.203: U$14.85 70.47,25.28 70.81,25.63 73.52,25.63 v73.59,25.7
  Bottom 0.203: U$3.P$5 87.23,28.69 83.14,24.6 74.7,24.6 v73.59,25.7
D2  (via drill 0.3 pad 0.61)
  Top 0.203: v76.01,29.5 74.83,29.5 71.36,26.04 70.54,26.04 69.98,25.47 69.97,25.47 U$14.84
  Bottom 0.203: v76.01,29.5 76.53,29.5 76.84,29.81 98.37,29.81 U$3.P$6
D3  (via drill 0.3 pad 0.61)
  Top 0.203: U$14.83 69.47,25.55 69.99,26.07 70.01,26.07 70.53,26.59 v70.77,26.59
  Route15 0.203: v70.77,26.59 71.16,26.98 71.16,28.97 78.23,36.05 92.13,36.05 U$3.P$7
D4  (via drill 0.3 pad 0.61)
  Top 0.203: 68.97,25.47 | 68.97,25.47 68.97,25.64 69.81,26.48 69.84,26.48 70.51,27.15 71.56,27.15 74.67,30.26 v76.27,30.26 | U$14.82 68.97,25.47
  Bottom 0.203: U$3.P$8 98.38,32.34 79.15,32.34 78.9,32.1 78.1,32.1 v76.27,30.26
D5  (via drill 0.3 pad 0.61)
  Top 0.203: v68.34,26.16 68.47,26.02 68.47,25.47 U$14.81
  Route15 0.203: U$3.P$9 94.26,36.46 78.07,36.46 68.34,26.73 v68.34,26.16
D6  (via drill 0.3 pad 0.61)
  Top 0.203: v77.34,33.77 75.16,33.77 67.78,26.39 67.78,25.93 67.97,25.73 67.97,25.47 U$14.80
  Route2 0.203: U$3.P$10 98.38,32.66 82.5,32.66 81.88,33.28 77.83,33.28 v77.34,33.77
D7  (via drill 0.3 pad 0.61)
  Top 0.203: v67.44,26.85 67.37,26.77 67.37,25.76 67.47,25.66 U$14.79
  Route15 0.203: U$3.P$11 96.39,36.87 77.46,36.87 v67.44,26.85
D+
  Top 0.203: R25.2 93.15,9.25 U$2.D+
D-
  Top 0.203: U$2.D- 89.62,9.39 R24.2
EMLE  (via drill 0.3 pad 0.61)
  Top 0.203: v82.32,22.68 82.32,22.91 EMLE.TP 82.99,25.27 | 82.99,25.27 81.29,26.97 U$14.2 | R15.1 82.99,25.27
  Route2 0.203: JP2.4 80.08,20.44 v82.32,22.68
ENABLE_PANDA
  Bottom 0.203: R45.2 12.1,16.5 12.16,16.44 12.16,15.5 | 12.16,15.5 12.9,15.5 13.52,14.88 U$5.3 | R20.1 12.16,15.5
ENABLE_PWR  (via drill 0.3 pad 0.61)
  Top 0.203: v68.6,32.83 69.14,32.83 73.97,37.66 U$14.34
  Bottom 0.203: X2.30 45.74,30.77 56.18,30.77 57.89,32.49 68.26,32.49 v68.6,32.83
EXTAL
  Top 0.203: U$14.13 80.97,32.47 83.37,34.86 84.47,34.86 X1.P$2 85.93,36.12 86.3,36.49 C7.2
GND  (via drill 0.3 pad 0.61, 0.6 pad 0.3, 0.6 pad 0.61)
  Top 0.12: 18.04,44.55 18.05,44.55 U$17.PAD@1 | U$17.P$3 17.95,44.45 18.04,44.54 | U$18.PAD@1 27.08,44.58 26.95,44.45 U$18.P$3 | U$19.P$3 35.95,44.45 U$19.PAD@1 | U$16.P$3 8.95,44.45 U$16.PAD@1
  Top 0.14: C49.2 99.85,21.72 100.58,22.45 100.58,24.05 99.93,24.69 98.32,24.69 | 92.12,32.26 93.27,31.11 93.27,27.58 93.08,27.39 90.97,27.39 | 97.46,24.12 U$3.P$1 | 98.03,24.69 97.55,24.21 | C4.1 88.95,27.39
  Top 0.15: U$17.P$3 17.95,42.85 C35.2 | v40.61,44.73 40.59,44.73 C33.2
  Top 0.203: C20.2 60,24.78 U1.18 61.39,23.1 v62.01,22.47 | v65.92,31.93 65.92,32.02 64.97,32.97 U$14.62 60.73,32.97 60.15,33.55 | 68.56,45.04 53.64,45.04 53.5,44.9 C53.1 52,44.9 52,45.38 51.63,45.75 U$6.P$2 U$6.PAD U$6.P$5 48.87,45.75 48.5,46.12 48.5,46.6 C54.1 47,46.6 46.16,45.77 40.57,45.77 C33.2 38.97,44.71 38.97,44.85 38.56,45.25 U$19.PAD@1 33.75,45.25 33.25,44.75 C30.2 30.04,44.75 30.03,44.76 30.03,45.25 U$18.PAD@1 | 68.56,45.04 68.56,47.95 68.71,48.1 70.04,48.1 | 68.56,45.04 71.38,42.22 v71.6,42.22 71.6,41.84 71.97,41.47 U$14.38 | 70.04,48.1 70.7,47.44 70.7,47.35 R26.2 | 70.04,48.1 70.04,49.16 73.48,52.6 74,52.6 74,52.97 | C46.2 60.15,33.55 | 60.15,33.55 56.78,33.55 C12.2 54.73,33.55 54.72,33.55 R18.2 | v30.89,19.14 30.98,19.05 C18.- 34.16,19.05 34.58,18.63 40.88,18.63 41.26,19.01 42.77,19.01 42.88,18.9 42.88,16.57 | 13.81,44.84 13.81,41.61 14.12,41.3 12.26,39.45 8.67,39.45 7.85,40.26 C32.2 | 13.81,44.84 15.3,44.84 15.66,45.21 17.38,45.21 18.04,44.55 18.04,44.54 | 13.81,44.84 C39.2 12.09,44.84 12.03,44.9 12.03,45.25 U$16.PAD@1 | v34.77,40.45 34.85,40.53 C38.2 | X3.2 76.24,14.4 76.24,16.06 76.82,16.64 C8.2 77.57,17.45 C15.2 80.31,17.45 | 80.31,17.45 C13.2 81.82,17.45 81.82,17.82 82.42,18.43 84.19,18.43 84.47,18.71 84.47,19.18 | 80.31,17.45 | 92.12,32.26 C11.1 C9.1 88.73,32.26 87.59,33.39 C6.1 | U$14.12 81.52,31.97 82.94,33.39 C6.1 | C6.1 C7.1 | C48.2 81.89,22.12 82.08,21.94 83.74,21.94 | 83.74,21.94 84.82,23.02 R15.2 84.82,26.6 | 83.74,21.94 84.47,21.2 84.47,19.18 | C14.2 84.47,19.18 | 77.47,25.47 U$14.99 | 77.47,25.47 77.47,25.97 78.97,27.47 U$14.3 81.59,27.47 82.47,26.6 84.82,26.6
  Top 0.203: 77.47,25.47 74.97,25.47 U$14.94 | 74,52.97 74.82,52.97 75.2,53.35 R8.1 R12.1 R14.1 R28.1 R29.1 R30.1 R31.1 | R7.1 74,52.97 | 55.47,15.8 v55.47,15.23 | 53.27,21.29 53.98,20.58 53.98,19.02 53.6,18.64 53.6,17.39 54.23,16.75 54.3,16.75 U$4.2 55.1,16.18 55.47,15.8 | C22.2 53.27,22.84 53.27,21.29 | C40.2 53.27,21.29 | 27.08,44.58 26.45,45.21 24.59,45.21 24.09,44.71 C36.2 21.95,45.25 U$17.PAD@1 | 67.56,17.46 C10.2 69.07,17.46 69.08,17.47 C17.2 71.8,17.47 71.81,17.46 C1.2 73.32,17.46 73.33,17.47 C2.2 | C29.2 25.85,41 25.5,41 v24.63,40.12 | C4.1 84.83,26.61 84.82,26.6 | 67.56,17.46 C3.2 65.38,17.46 65.37,17.47 C5.2 63.25,17.47 63.24,17.45 C21.2 61.12,17.45 60.7,17.03 60.7,16.97 C19.2 59.9,16.22 59.48,15.8 55.47,15.8 | 67.56,17.46 | R2.2 47.44,16.62 47.42,16.61 R4.2 45.82,16.61 45.78,16.57 R13.2 42.88,16.57 | R17.2 42.86,16.55 42.88,16.57 | 98.32,24.69 98.03,24.69 | 97.55,24.21 97.46,24.12 96.35,24.12 93.08,27.39 | 88.95,27.39 90.97,27.39
  Route2 0.203: 55.35,9.24 S8.2 | 55.47,9.24 55.35,9.24 | 55.35,9.24 55.35,2.35 S9.2 | S8.1 55.47,9.24 | 55.47,9.24 v55.47,15.23 | v65.92,31.93 68.07,34.07 68.07,38.87 68.39,39.2 68.58,39.2 v71.6,42.22 | 83.64,5.77 D8.2 | 91.75,5.65 83.76,5.65 83.64,5.77 | 83.64,5.77 JP2.2 | 91.75,5.65 U$2.GND | U$2.S1 91.75,4.7 91.75,5.65 | 23.31,28.74 23.31,38.81 v24.63,40.12 | 23.31,28.74 23.55,28.5 28.23,28.5 X2.17 29.5,20.53 v30.89,19.14 30.89,18.92 U$1.N 35.91,11.97 | 23.31,28.74 20.37,28.74 X2.10 | S7.2 S7.1 | S6.1 36.52,11.97 35.91,11.97 | 35.91,11.97 35.48,11.97 S6.2
  Route15 0.203: S8.1 S2.2 63.91,9.24 JP2.14 JP2.12 69.92,9.24 | 69.92,9.24 70.08,9.24 X3.2 | S2.1 69.92,9.24 | 42.39,9.24 42.39,2.39 S1.2 | S7.2 42.39,9.24 | 42.39,9.24 S6.1 | S8.2 S7.1
  Bottom 0.203: 63.01,21.48 v62.01,22.47 | 56.48,16.23 59.74,16.23 64,20.49 63.01,21.48 | 63.01,21.48 65.47,23.94 65.47,26.04 SG1.2 65.47,29.55 65.92,30 v65.92,31.93 | v55.47,15.23 56.47,16.23 56.48,16.23 | 56.48,16.23 C24.2 55.07,16.98 52.28,19.77 52.28,20.19 C26.2 52.28,21.28 54.11,23.1 U2.18 55.85,24.76 C25.2 | C42.2 12.11,39.38 12.14,39.4 | 25.94,17.33 25.45,17.81 R37.2 | 25.66,14.74 25.94,15.02 25.94,17.33 | v30.89,19.14 27.74,19.14 25.94,17.33 | 25.66,14.74 25.28,14.74 24.92,14.37 24.35,14.37 | R21.1 25.66,14.74 | 76.19,34.59 76.19,35 | 76.19,35 76.19,37.72 71.69,42.22 v71.6,42.22 | 34.77,39.4 v34.77,40.45 | U$3.P$1 96.95,21.46 94.47,18.98 U$2.S2 94.47,9.47 U$2.GND | 35.88,39.4 C45.2 37.48,48.73 38.15,49.4 | 24.35,14.37 24.25,14.37 23.55,13.67 23.55,12.42 23.37,12.25 21.97,12.25 21.85,12.37 21.85,13.22 21.45,13.62 U$5.7 18.75,13.62 18.19,13.06 13.61,13.06 12.6,12.05 12.6,11.65 | 12.6,11.65 12.6,10.32 14.37,8.55 D100.1 19.13,8.55 19.6,8.55 19.6,7.93 20.19,7.34 C57.2 | 12.6,11.65 10.75,11.65 C56.2 10.75,5.55 10.71,5.51 | 10.71,5.51 11.22,5 C100.- | 10.71,5.51 C58.- 6.98,6.17 5.47,7.67 5.47,12.32 R45.1 C55.1 | C51.2 24.35,14.37 | 24.63,39.4 v24.63,40.12 | C47.2 76.15,35 76.19,35
  Bottom 1.6: 12.14,39.4 C43.2 24.63,39.4 C44.2 34.77,39.4 35.88,39.4
  Bottom 3: C50.2 45.5,54.75
  other vias: 69.75,37.5 69.75,36 69.75,31 68.5,29.75 75.25,26.5 72.75,33.5 73.5,35.75 77.86,37.95 62.61,40.95 89.11,34.45 91.36,34.45 62.61,44.2 62.61,45.95 71.11,43.95 78.96,43.35 80.96,43.35 82.96,43.35 84.96,43.35 86.96,43.35 88.96,43.35 78.96,45.1 80.96,45.1 82.96,45.1 84.96,45.1 86.96,45.1 88.96,45.1 93.11,22.7 85.61,20.7 83.11,20.7 95.11,22.2 86.36,11.45 86.36,4.2 91.61,11.7 98.36,9.45 97.36,5.2 70.61,11.7 71.36,8.7 82.86,14.7 82.36,8.95 21.36,23.2 23.11,23.2 24.86,23.2 26.61,23.2 28.36,23.2 30.61,23.2 32.36,23.2 34.11,23.2 24.86,19.7 20.86,19.7 6.11,30.95 6.11,25.95 6.11,27.45 6.11,29.45 12.86,42.95 33.11,39.45 13.68,44.93 56.11,45.95 45.36,40.7 42.61,38.2 43.36,40.7 43.11,44.7 44.86,44.7 44.86,48.2 53.86,40.95 58.61,40.95 45.61,34.2 48.11,34.2 54.61,29.7 57.11,29.7 20.18,6.3 13.82,9.11 17.49,13.04 23.14,11.42 10.75,10.57 11.21,3.52 6.98,5.49 24.14,11.42 28.64,10.67 28.64,9.67 28.64,8.67 28.64,7.67 28.14,6.67 22.64,7.67 26.14,11.42 22.14,11.42 27.14,6.67 26.14,6.67 24.64,6.67 23.64,6.67 22.64,6.67 21.64,7.92 20.64,7.92 18.39,11.67 17.39,11.67 17.14,10.67 17.14,7.67 17.89,6.92 28.64,5.67 28.64,4.67 28.64,3.67 28.64,2.67 28.64,1.67 27.39,1.42 26.39,1.42 25.39,1.42 24.39,1.42 23.39,1.42 22.39,1.42 21.39,1.42 20.39,1.42 19.39,1.42 18.39,1.42 17.39,1.42 17.89,5.92 7.89,13.17 28.89,16.42 29.89,16.42 30.89,16.42 31.89,16.42 17.64,17.17 16.64,17.17 18.64,17.17 7.86,40.2 9.74,45.25 18.74,45.25 27.74,45.25 36.74,45.25 31.64,43.39 22.12,43.37 2.62,12.37 2.62,13.62 2.62,14.87 2.62,11.12 2.62,9.87 2.62,8.62 9.37,8.62 10.62,8.62 17.5,14.41 35.88,16.58 35.47,19.76 51.02,11.48 61.07,11.19 54.24,24.56 49.01,25.05 90.57,25.99 89.21,15.58 73.46,14.58 67.21,16.08 69.21,21.83 85.46,38.33 86.71,38.33 87.96,38.33 89.21,38.33 90.46,38.33 91.71,38.33 70.71,33.33 69.46,34.08 75.96,31.08 71.21,14.83 77.96,16.58 86.71,25.33 88.21,26.33 86.21,28.83 94.21,31.08 94.21,27.58 93.21,26.08 95.71,16.58 14.96,20.08 8.96,20.08 8.96,19.08 8.96,18.08 8.96,17.08 13.25,36.5 47.36,36.2 50.61,36.2 59.11,35.34
  pour Top: 0,57 8.25,57 8.25,46 44.25,46 44.25,57 102,57 102,0 0,0
  pour Route2: 102,57 32.5,57 32.5,27.75 22.75,27.75 22.75,38 0,38 0,0 102,0
  pour Route15: 0,57 101.75,57 101.75,0.25 0,0.25
  pour Bottom: 0,57 8.25,57 8.25,49.5 44.5,49.5 44.5,57 102,57 102,0 0,0
IBAT0_AD  (via drill 0.3 pad 0.61)
  Top 0.203: v61.02,18.31 68.92,18.31 69.68,19.07 69.68,19.17 C17.1 71.19,19.17 71.19,19.92 72.97,21.7 U$14.90
  Route15 0.203: v61.02,18.31 58.22,18.31 56.13,20.4 38.87,20.4 X2.19
IBAT1_AD  (via drill 0.3 pad 0.61)
  Top 0.203: C10.1 69.07,19.16 69.07,19.48 v69.27,19.69 69.45,19.69 72.47,22.7 U$14.89
  Route2 0.203: X2.21 46.02,15.79 65.38,15.79 v69.27,19.69
IBAT2_AD  (via drill 0.3 pad 0.61)
  Top 0.203: v65.31,20.06 65.38,19.99 65.38,19.16 C3.1 66.89,19.16 68.52,20.79 69.96,20.79 71.97,22.8 U$14.88
  Route2 0.203: X2.23 45.7,18.65 52.24,18.65 54.29,16.6 61.86,16.6 v65.31,20.06
IBAT3_AD  (via drill 0.3 pad 0.61)
  Top 0.203: 64.01,19.97 63.83,20.15 v62.83,20.15 | U$14.87 71.55,24.39 71.55,23.01 69.73,21.2 65.23,21.2 64.01,19.97 | C5.1 64.01,19.97
  Route15 0.203: X2.25 46.02,20.88 56.97,20.88 58.5,19.35 62.03,19.35 v62.83,20.15
IMON1
  Top 0.203: X2.27 46.59,22.84 R35.1
IMON2
  Top 0.203: X2.29 48.19,23.78 48.19,22.01 R36.1
INT_GYRO1  (via drill 0.3 pad 0.61)
  Top 0.203: U$14.51 62.55,38.47 v61.99,37.91 | U1.12 59.71,19.72 v59.9,19.91
  Route15 0.203: v59.9,19.91 59.9,20.73 61.31,22.15 61.31,24 61.27,24.04 61.27,24.59 60.09,25.77 60.09,34.21 61.26,35.38 61.26,37.18 v61.99,37.91
INT_GYRO2  (via drill 0.3 pad 0.61)
  Top 0.203: v65.18,37.97 U$14.52
  Route2 0.203: v56.02,19.69 56.02,21.28 60.24,25.5 60.98,25.5 61.59,26.11 62,26.11 62.38,26.49 62.38,27.35 62.15,27.58 62.15,28.53 63.34,29.72 63.34,35.62 65.18,37.46 v65.18,37.97
  Bottom 0.203: U2.12 56.62,19.69 v56.02,19.69
LED0
  Top 0.203: LED0.A TPLED0.TP 76.97,43.53 U$14.28
LED1
  Top 0.203: U$14.27 77.47,45.03 TPLED1.TP LED1.A
LED2
  Top 0.203: LED2.A TPLED2.TP 77.97,46.47 U$14.26
LED3
  Top 0.203: LED3.A TPLED3.TP 80,38.5 U$14.25
LED4
  Top 0.203: U$14.24 80.74,37.97 82,39.23 TPLED4.TP LED4.A
LED5
  Top 0.203: U$14.23 80.97,37.47 84,40.5 TPLED5.TP LED5.A
LED6/TDO  (via drill 0.3 pad 0.61)
  Top 0.203: v74.03,34.31 76.69,36.97 U$14.22 81.07,36.97 86,41.9 TPLED6.TP LED6.A
  Route2 0.203: JP2.5 78.57,4.26 78.57,8.05 76.75,9.87 76.75,18.71 77.31,19.27 77.31,25.96 74.03,29.24 v74.03,34.31
LED7/TCK  (via drill 0.3 pad 0.61)
  Top 0.203: 82.19,36.47 v82.19,35.47 | 82.19,36.47 U$14.21 | 82.19,36.47 88,42.28 TPLED7.TP LED7.A
  Route2 0.203: JP2.1 81.58,2.19 70.95,2.19 JP2.11
  Route15 0.203: JP2.1 81.35,4.5 81.35,7.51 80.27,8.59 80.27,11.92 81.51,13.16 81.51,23.53 82.19,24.2 v82.19,35.47
LED_BLUE  (via drill 0.3 pad 0.61)
  Top 0.203: v74.67,38.27 74.67,39.26 74.47,39.47 U$14.33 | v88.68,19.14 88.89,19.14 R34.2
  Route2 0.203: v88.68,19.14 88.68,19.96 75.08,33.56 75.08,37.25 74.67,37.66 v74.67,38.27
LED_GREEN  (via drill 0.3 pad 0.61)
  Top 0.203: v90.78,19.13 91.01,19.13 R33.2 | v75.63,37.49 75.63,39.3 75.47,39.47 U$14.31
  Route2 0.203: v75.63,37.49 75.63,33.58 90.08,19.13 v90.78,19.13
LED_RED  (via drill 0.3 pad 0.61)
  Top 0.203: U$14.29 v76.47,38.27 | v93.94,20.11 R32.2
  Route2 0.203: v76.47,38.27 76.47,33.84 78.31,32 78.9,32 90.79,20.11 v93.94,20.11
LX
  Top 0.203: U$6.P$1 51.19,44.77 50.89,44.48 U$6.P$7
MD  (via drill 0.3 pad 0.61)
  Top 0.203: 81.37,29.47 82.33,29.47 82.37,29.51 R5.1 | U$14.7 81.37,29.47 | v81.37,28.74 81.37,29.47
  Route15 0.203: v81.37,28.74 80.42,27.79 80.42,12.64 76.27,8.49 76.27,4.5 JP2.7 72.66,0.89 48.11,0.89 S1.1
MISOA  (via drill 0.3 pad 0.61)
  Top 0.203: v68.63,38.55 68.47,38.71 U$14.45 68.47,42.48 68.21,42.74 R9.2
  Route2 0.203: v68.63,38.55 68.63,34.01 67.44,32.83 67.44,27.64 62.57,22.76 62.57,21.59 v62.34,21.35
  Bottom 0.203: v62.34,21.35 62.34,20.49 60.4,18.55 58.53,18.55 58.19,18.89 58.19,18.96 U2.9
MISOB  (via drill 0.3 pad 0.61)
  Top 0.203: U$14.71 62.88,28.47 v62.74,28.33 | U1.9 57.65,18.85 v57.2,18.4
  Route2 0.203: v57.2,18.4 57.2,21.89 60.33,25.02 61.08,25.02 61.76,25.7 62.17,25.7 62.81,26.34 62.81,28.26 v62.74,28.33
MOSIA  (via drill 0.3 pad 0.61)
  Top 0.203: U$14.46 67.97,39.47 68.05,39.39 68.05,38.73 66.16,36.84 v65.84,36.84
  Route2 0.203: v60.72,23.68 61.27,24.23 61.27,24.5 62.06,25.3 62.34,25.3 63.74,26.71 63.74,34.75 v65.84,36.84
  Bottom 0.203: U2.24 59.45,23.68 v60.72,23.68
MOSIB
  Top 0.203: U$14.72 64.97,27.97 64.97,26.14 64.78,25.95 60.49,25.95 60.33,26.11 58.06,26.11 56.64,24.69 U1.24
N$2
  Top 0.203: R7.2 LED0.C
N$3
  Top 0.203: C4.2 82.33,27.39 81.69,28.03 81.24,28.03 80.8,28.47 U$14.5
N$4
  Top 0.203: D8.1 84.91,12.9 86.66,14.65 91.92,14.65 93.94,16.67 R32.1
N$7  (via drill 0.3 pad 0.61)  (2 unrouted)
  Top 0.203: 55.83,17.91 57.53,16.22 58.91,16.22 59,16.3 59,18.37 58.69,18.68 U1.11 | U$4.3 55.38,17.82 55.47,17.91 55.83,17.91 | 55.83,17.91 | 55.83,17.91 v56.31,18.39
  Bottom 0.203: U2.11 57.15,18.96 56.88,18.96 v56.31,18.39
N$8
  Top 0.203: R8.2 LED1.C
N$9
  Top 0.203: R12.2 LED2.C
N$10
  Top 0.203: R14.2 LED3.C
N$11
  Top 0.203: R28.2 LED4.C
N$12
  Top 0.203: R29.2 LED5.C
N$13
  Top 0.203: R30.2 LED6.C
N$14
  Top 0.203: R31.2 LED7.C
N$15
  Top 0.203: R33.1 91.81,16.68 87.07,16.68 82.36,11.97 D8.3
N$17
  Top 0.203: R34.1 87.18,17.44 82.64,12.9 81.09,12.9 D8.4
N$18
  Top 0.152: C37.1 34.77,48.43 34.77,47.92 35.01,47.68 35.31,47.68 35.55,47.44 35.55,47.38 U$19.P$7
N$19
  Top 0.152: C31.1 15.9,47.7 17.23,47.7 17.55,47.38 U$17.P$7
N$20
  Top 0.12: U$19.P$6 35.95,48.17 C37.2
N$21
  Top 0.12: U$17.P$6 17.95,48.08 C31.2
N$22
  Top 0.152: C27.1 6.87,47.68 8.25,47.68 8.55,47.38 U$16.P$7
N$23
  Top 0.12: U$16.P$6 8.95,48.03 C27.2
N$24
  Top 0.152: C34.1 24.89,47.7 25.21,47.38 26.55,47.38 U$18.P$7
N$25
  Top 0.12: U$18.P$6 26.95,48.07 C34.2
N$96
  Bottom 0.203: U$5.4 13.55,16.16 13.55,17.3 C55.2
N$109
  Bottom 0.203: U$5.6 21.71,14.88 21.85,14.75 C51.1 C52.1
N$120
  Bottom 0.203: C52.2 25.15,13 25.19,13.04 R21.2
N$121
  Bottom 0.203: C28.2 13.65,11.5 13.55,11.61 13.55,12.35 U$5.1
N$125
  Bottom 0.203: 22.22,16.28 22.64,16.7 R37.1 | 22.22,16.28 21.82,16.28 21.69,16.16 U$5.5 | R38.2 22.22,16.28
N$138  (via drill 0.3 pad 0.61)
  Top 0.203: v15.25,9.5 v21.5,9.5
  Bottom 0.203: C28.1 15.25,10.65 v15.25,9.5 | v21.5,9.5 D100.3
  Bottom 1.27: U$5.8 20.1,11.97 | D100.3 v21.5,9.5 | 23.5,9.5 23.6,9.4
  Bottom 1.6: D100.3 20.85,11.22 20.1,11.97 | L7.1 23.6,9.4 | v21.5,9.5 23.5,9.5
NMI  (via drill 0.3 pad 0.61)
  Top 0.203: U$14.15 79.88,33.39 78.48,33.39 77.9,32.8 76.53,32.8 71.33,27.6 70.17,27.6 v70.03,27.46 | R6.1 25.91,16.72 26.22,16.72 v26.5,17
  Route15 0.203: v26.5,17 27,17.51 61.06,17.51 63.39,19.84 63.39,20.42 69.61,26.63 69.61,27.04 v70.03,27.46
OUT1_EN  (via drill 0.3 pad 0.61)
  Top 0.203: v62.09,36.35 62.22,36.47 62.97,36.47 U$14.55
  Bottom 0.203: X2.18 32.63,32.9 48.73,32.9 52.37,36.54 61.9,36.54 v62.09,36.35
OUT2_EN
  Top 0.203: X2.20 34.37,32.1 39.61,32.1 43.23,35.72 43.23,37 44.06,37.83 61.2,37.83 61.72,37.31 62.26,37.31 62.42,37.47 62.97,37.47 U$14.53
OUT3_EN  (via drill 0.3 pad 0.61)
  Top 0.203: U$14.4 v74.13,27.97
  Bottom 0.203: X2.22 36.01,31.2 54.56,31.2 56.25,32.9 66.91,32.9 67.4,33.39 68.83,33.39 74.13,28.09 v74.13,27.97
OUT4_EN  (via drill 0.3 pad 0.61)
  Top 0.203: U$14.41 70.47,41.86 v70.44,41.89
  Route2 0.203: X2.24 38.19,28.7 61.17,28.7 62.52,30.06 62.52,35.99 62.65,36.12 62.65,39.25 66.27,42.87 69.46,42.87 v70.44,41.89
OUT5_EN  (via drill 0.3 pad 0.61)
  Top 0.203: U$14.98 76.97,23.24 v76.32,22.59
  Route2 0.203: X2.26 38.63,30.8 36.71,30.8 36.03,30.12 36.03,29.43 37.11,28.35 37.45,28.35 38.39,27.4 38.39,27 41.35,24.05 48,24.05 54.63,17.42 59.2,17.42 64.38,22.59 v76.32,22.59
PGOOD1  (via drill 0.3 pad 0.61)
  Top 0.203: v61.24,38.66 62.05,39.47 66.47,39.47 U$14.49
  Route15 0.203: X2.31 48.55,28.5 48.55,29.95 57.26,38.66 v61.24,38.66
PGOOD2  (via drill 0.3 pad 0.61)
  Top 0.203: U$14.50 v65.34,40.47
  Route2 0.203: X2.33 60.27,27.23 62.93,29.89 62.93,35.82 63.06,35.95 63.06,38.19 v65.34,40.47
PWM0  (via drill 0.3 pad 0.61)
  Top 0.152: v60.92,29.31 61.26,28.97 62.99,28.97 U$14.70 | U$16.P$8 v7.57,46.85
  Route2 0.152: v7.57,46.85 8.13,47.41 30.06,47.41 34.35,43.12 47.12,43.12 v60.92,29.31
PWM1  (via drill 0.3 pad 0.61)
  Top 0.152: v57.91,31.31 58.58,31.31 58.63,31.26 62.7,31.26 62.99,30.97 U$14.66 | U$17.P$8 v16.56,46.85
  Route2 0.152: v16.56,46.85 29.71,46.85 33.75,42.81 46.41,42.81 v57.91,31.31
PWM2  (via drill 0.3 pad 0.61)
  Top 0.152: U$18.P$8 25.66,46.85 v25.12,46.31 | v65.19,31.59 65.19,31.73 64.95,31.97 U$14.64
  Route15 0.152: v65.19,31.59 63.23,33.54 63.23,37.88 61.22,39.89 51.34,39.89 44.84,46.4 25.2,46.4 v25.12,46.31
PWM3  (via drill 0.3 pad 0.61)
  Top 0.152: v34.56,47.11 34.83,47.38 35.15,47.38 U$19.P$8 | U$14.61 66.51,33.47 v66.56,33.52
  Route15 0.152: v66.56,33.52 66.01,34.06 66.01,35.53 59.66,41.89 50.57,41.89 45.34,47.11 v34.56,47.11
PWM4  (via drill 0.3 pad 0.61)
  Top 0.203: v59.94,35.97 61.68,35.97 61.86,35.79 62.33,35.79 62.51,35.97 62.97,35.97 U$14.56
  Route15 0.203: X2.34 56.02,35.97 v59.94,35.97
PWM5
  Top 0.203: X2.32 51.86,34.35 56.8,34.35 59.35,36.91 62.9,36.91 62.97,36.97 U$14.54
REGOUT1
  Top 0.203: C19.1 58.2,17.73 58.19,17.73 U1.10
REGOUT2
  Bottom 0.203: U2.10 57.66,18.81 58.18,18.29 C24.1
RSPCKA  (via drill 0.3 pad 0.61)
  Top 0.203: v67.47,39.01 67.47,39.47 U$14.47
  Route15 0.203: v60.65,26.57 61.85,27.77 63.1,27.77 67.47,32.14 v67.47,39.01
  Bottom 0.203: v60.65,26.57 58.77,24.69 58.69,24.69 U2.23
RSPCKB
  Top 0.203: U$14.77 66.47,25.47 60.28,25.47 60.06,25.7 58.32,25.7 57.15,24.53 U1.23
SSLA0  (via drill 0.3 pad 0.61)
  Top 0.203: v66.25,38.7 66.33,38.7 66.97,39.34 U$14.48
  Route2 0.203: v61.83,24.27 61.88,24.27 64.15,26.54 64.15,32.56 65.87,34.28 65.87,34.92 66.42,35.48 66.42,38.53 v66.25,38.7
  Bottom 0.203: v61.83,24.27 61.45,23.9 61.45,22.24 61.57,22.12 61.57,20.3 60.23,18.96 58.69,18.96 U2.8
SSLB0
  Top 0.203: U$14.74 62.97,26.97 62.67,26.97 62.41,27.23 58.57,27.23 55.08,23.74 55.08,19.84 55.97,18.96 57.15,18.96 U1.8
SUPERCAP  (via drill 0.3 pad 0.61)
  Top 0.203: U$14.6 76.3,28.97 76.07,28.74 v75.84,28.74 | U$1.P 31.94,12.87 D7.3
  Bottom 0.203: U$1.P 37.81,10.79 43.66,10.79 47.84,14.97 54.94,14.97 55.24,14.67 55.7,14.67 56.08,15.05 61.28,15.05 70.67,24.44 71.54,24.44 v75.84,28.74
USB0_DM  (via drill 0.3 pad 0.61)
  Top 0.203: U$14.36 72.97,38.13 v72.89,38.05 | v88.59,13.24 88.67,13.24 88.82,13.09 R24.1
  Route2 0.203: v88.59,13.24 88.07,13.77 88.07,19.99 74.61,33.45 74.61,36.33 v72.89,38.05
USB0_DP  (via drill 0.3 pad 0.61)
  Top 0.203: v95.6,10.49 R25.1 | U$14.37 72.47,41.47 73.47,42.47 v73.47,42.51 73.47,42.64 72.99,43.11 R10.2
  Route2 0.203: v95.6,10.49 100.61,15.49 100.61,39.33 99.81,40.12 99.23,40.12 98.22,41.13 98.22,41.65 97.36,42.51 v73.47,42.51
USB0_DPUPE
  Top 0.203: R10.1 74.69,42.71 74.97,42.43 U$14.32
USB0_VBUS
  Top 0.203: U$14.30 75.97,43.65 74.02,45.6 72.36,45.6 72.3,45.65 R26.1 70.7,45.65 70.69,45.64 R27.2
V+
  Bottom 0.203: X2.12 20.53,28.42 20.53,26.12 17.36,22.94 15.43,22.94 13.54,22.94 12.96,22.36 12.96,21.02 11.3,19.36 11.3,16.68 10.87,16.25 10.4,16.25 R20.2 10.4,14.75 10.46,14.75 10.75,14.45 10.75,13.93 | 13.5,13.66 13.55,13.62 | 10.75,13.93 10.75,13.66 C56.1 | C58.+ 8.48,10.56 8.48,11.66 10.75,13.93
  Bottom 0.45: U$5.2 13.55,13.62 | 10.75,13.66 13.5,13.66
VBAT0
  Top 1.27: L2.2 10.5,32.94 9.18,31.62 X2.2
  Route15 2.2: X2.2 X2.1
  Bottom 1.27: X2.1 R16.1
  Bottom 1.6: C42.1 10.51,34.96 9.18,33.63 X2.2
VBAT0_AD  (via drill 0.3 pad 0.3, 0.3 pad 0.61)
  Top 0.203: 41.19,15 44.45,15 46.9,12.54 66.34,12.54 69.95,16.15 75.45,16.15 76.05,16.74 76.05,18.16 76.14,18.25 77.43,18.25 78.19,19.01 78.19,19.15 | 41.19,15 41.19,17.1 41.59,17.5 42.06,17.5 R17.1 | 41.19,15 v30.39,15 | U$14.95 75.47,23.11 75.32,22.96 75.32,22.16 78.19,19.29 78.19,19.15 | C15.1 78.19,19.15
  Route15 0.203: v30.39,15 | v30.39,15 25.25,15 21.75,18.5 15,18.5 13.75,19.75 11.25,19.75 10.46,20.54 v10.46,22.11
  Bottom 0.203: R16.2 9.99,22.18 10.06,22.11 v10.46,22.11
VBAT1
  Top 1.27: L3.2 16.95,35 X2.4
  Route15 2.2: X2.4 X2.3
  Bottom 1.27: X2.3 R11.1
  Bottom 1.6: C43.1 16.11,36.6 11.86,32.41 X2.4
VBAT1_AD  (via drill 0.3 pad 0.61)
  Top 0.203: v43.52,19.26 43.75,19.03 44.28,19.03 R13.1 44.68,18.27 45.08,18.27 45.8,17.55 49.38,17.55 49.72,17.22 49.72,15.25 50.38,14.58 51.28,14.58 51.65,14.96 54.96,14.96 55.24,14.67 55.7,14.67 55.99,14.96 67.6,14.96 69.21,16.56 75.21,16.56 75.64,16.99 75.64,18.72 76.06,19.15 | 76.06,19.15 76.06,20.04 74.47,21.64 74.47,23.47 U$14.93 | C8.1 76.06,19.15
  Route15 0.203: v43.52,19.26 39.44,19.26 37.5,21.19 v12.28,21.19
  Bottom 0.203: R11.2 11.72,21.42 12.05,21.42 v12.28,21.19
VBAT2
  Top 1.27: X2.6 16.82,32.33 25.83,32.33 L4.2
  Route15 2.2: X2.6 X2.5
  Bottom 1.27: X2.5 R3.1
  Bottom 1.6: X2.6 18.23,33.74 26,33.74 C44.1
VBAT2_AD  (via drill 0.3 pad 0.61)
  Top 0.203: U$14.92 v73.97,20.95 73.97,20.7 74.69,19.97 C2.1 | R4.1 46.62,19.14 v46.85,19.38
  Route2 0.203: v46.85,19.38 52.09,19.38 54.46,17.01 61.41,17.01 65.35,20.95 v73.97,20.95 | v73.97,20.95
  Bottom 0.203: v46.85,19.38 44.8,21.43 14.26,21.43 R3.2
VBAT3  (via drill 0.9 pad 0.61)
  Top 1.27: L5.2 v37.06,35
  Route15 1.27: 16.8,31 17,32
  Route15 2.4: 16.8,31 X2.8 X2.7
  Route15 4: 17,32 18.53,35 v37.06,35
  Bottom 1.27: R1.1 16.8,25.2 X2.7
  Bottom 1.6: C45.1 37.32,36.6 37.32,35.26 v37.06,35
VBAT3_AD  (via drill 0.3 pad 0.61)
  Top 0.203: U$14.91 73.47,23.47 73.47,21.28 v72.57,20.38 C1.1 | R2.1 49.69,18.32 49.69,18.3 v49.9,18.09
  Route2 0.203: v49.9,18.09 51.8,16.2 64.7,16.2 68.89,20.38 v72.57,20.38
  Bottom 0.203: R1.2 45.8,22.19 v49.9,18.09
VBUS  (via drill 0.3 pad 0.61)
  Top 0.203: v50.55,43.35 49.34,43.35 48.54,42.56 D2.A | v70.29,46.52 69.44,46.52 69.38,46.59 R27.1
  Route2 0.203: v50.55,43.35 67.12,43.35 v70.29,46.52 72.58,44.22 98.25,44.22 101.01,41.46 101.01,15.11 94,8.1 91.11,8.1 U$2.VBUS
VIN  (via drill 0.3 pad 0.61, 0.9 pad 0.61)
  Top 0.12: U$19.P$5B 36.75,47.41 36.35,47.41 U$19.P$5A | U$18.P$5B 27.75,47.41 27.35,47.41 U$18.P$5A | U$17.P$5B 18.75,47.41 18.35,47.41 U$17.P$5A | U$16.P$5B 9.75,47.41 9.35,47.41 U$16.P$5A
  Top 0.25: 30.1,48.2 29.59,47.69 29.35,47.45 U$18.P$5F U$18.P$5E 28.64,47.16 | 30.85,48.35 30.4,47.9 | U$16.P$5E 10.95,47.16 | 11.26,47.16 11.11,47.16 | 10.86,47.16 U$16.P$5D 10.55,47.16 | U$16.P$5F 11.35,47 11.35,47.16 11.35,47.45 | 10.46,47.16 U$16.P$5C U$16.P$5B | 38.26,47.16 U$19.P$5E 37.95,47.16 | 38.35,47.16 U$19.P$5F | 37.86,47.16 U$19.P$5D 37.55,47.16 | 37.46,47.16 U$19.P$5C 37.15,47.15 37.05,47.15 U$19.P$5B | U$18.P$5D 28.55,47.16 | 28.46,47.16 U$18.P$5C U$18.P$5B | 20.26,47.16 U$17.P$5E 19.64,47.16 | 20.35,47.45 20.35,47.16 20.35,47.15 U$17.P$5F | 19.46,47.16 U$17.P$5C U$17.P$5B | U$17.P$5D 19.55,47.16
  Top 1.27: 29.59,47.69 27.51,49.76 23.13,49.76 22.49,49.12 C36.1 20.4,47.51 20.35,47.45 20.35,48 18.55,49.8 14.24,49.8 13.69,49.25 13.69,48.04 | 30.4,47.9 30.1,48.2 | 31.64,48.35 31.64,49.16 32.26,49.78 32.3,49.78 | C30.1 31.64,48.35 | 31.64,48.35 30.85,48.35 | 10.86,47.16 10.95,47.16 11.11,47.16 | 11.35,47.16 11.26,47.16 | 13.69,48.04 11.94,48.04 11.35,47.45 | 10.55,47.16 10.46,47.16 | C39.1 13.69,48.04 | 38.41,47.51 38.41,47.98 36.61,49.78 32.3,49.78 | 32.3,49.78 v32.3,50.27 | 38.41,47.51 38.35,47.45 38.35,47.16 38.26,47.16 | 37.95,47.16 37.86,47.16 | 37.55,47.16 37.46,47.16 | 28.64,47.16 28.55,47.16 28.46,47.16 | 20.35,47.16 20.26,47.16 | 19.46,47.16 19.55,47.16 19.64,47.16 | C33.1 38.41,47.51
  Bottom 1.27: v32.3,50.27 32.24,50.33 D1.C 33.74,54.57 33.74,54.75 C50.1
  other vias: 11,51.75 18.5,51.75 32.25,53 40.75,51.75 29.75,53 38.75,51.75 36.75,51.75 34.75,51.75 13.5,51.75 16,51.75 21,51.75 27.5,51.75 11,54.25 16,54.25 21,54.25
  pour Top: 9,57 9,46.5 43.5,46.5 43.5,57
  pour Bottom: 43.5,50.25 43.5,57 9,57 9,50.25
VSW0
  Top 0.15: U$16.P$4B 9.75,43.54 U$16.P$4A
  Top 0.25: 11.26,43.34 U$16.P$4E 10.95,43.34 | 11.35,43.34 U$16.P$4F | 10.86,43.34 U$16.P$4D 10.55,43.34 | 10.46,43.34 U$16.P$4C U$16.P$4B
  Top 1.27: 11.35,43.34 11.26,43.34 | 10.95,43.34 10.86,43.34 | 10.5,43.34 10.46,43.34 | 10.55,43.34 10.5,43.34 | L2.1 10.5,43.34
VSW1
  Top 0.15: U$17.P$4C U$17.P$4B U$17.P$4A
  Top 0.25: 20.26,43.34 U$17.P$4E 19.95,43.34 | 20.32,43.34 20.35,43.36 U$17.P$4F | 19.86,43.34 U$17.P$4D 19.55,43.34 | 19.46,43.34 U$17.P$4C
  Top 1.27: 20.32,43.34 20.26,43.34 | 19.95,43.34 19.86,43.34 | 19.5,43.34 19.46,43.34 | 19.55,43.34 19.5,43.34 | 19.5,43.34 19.5,43.06 L3.1
VSW2
  Top 0.12: U$18.P$4A U$18.P$4B
  Top 0.25: 29.26,43.34 U$18.P$4E 28.95,43.34 | 29.35,43.34 U$18.P$4F | 28.86,43.34 U$18.P$4D 28.55,43.34 | 28.46,43.34 U$18.P$4C U$18.P$4B
  Top 1.27: 29.35,43.34 29.26,43.34 | 28.95,43.34 28.86,43.34 | 28.5,43.34 28.46,43.34 | 28.55,43.34 28.5,43.34 | 28.5,43.34 28.5,43.06 L4.1
VSW3
  Top 0.12: U$19.P$4A U$19.P$4B
  Top 0.25: 38.26,43.34 U$19.P$4E 37.95,43.34 | 38.35,43.34 U$19.P$4F | 37.86,43.34 U$19.P$4D 37.55,43.34 | 37.46,43.34 U$19.P$4C U$19.P$4B
  Top 1.27: 38.35,43.34 38.26,43.34 | 37.95,43.34 37.86,43.34 | 37.5,43.34 37.46,43.34 | 37.55,43.34 37.5,43.34 | 37.5,43.34 37.5,43.06 L5.1
XCIN
  Top 0.203: Q1.1 89.05,29.2 88.49,29.76 88.49,30.31 | 88.49,30.31 88.73,30.55 C9.2 | U$14.8 82.18,29.97 82.52,30.31 88.49,30.31
XCOUT
  Top 0.203: U$14.9 81.32,30.47 81.57,30.72 87.72,30.72 88.36,31.36 90.2,31.36 91,30.55 C11.2 91.76,29.75 92.1,29.41 Q1.4
XTAL
  Top 0.203: C6.2 86.44,31.69 86.01,32.12 X1.P$1 83.02,32.12 82.37,31.47 U$14.11